# Altium schematic sheet High Voltage Converter.SchDoc
size C
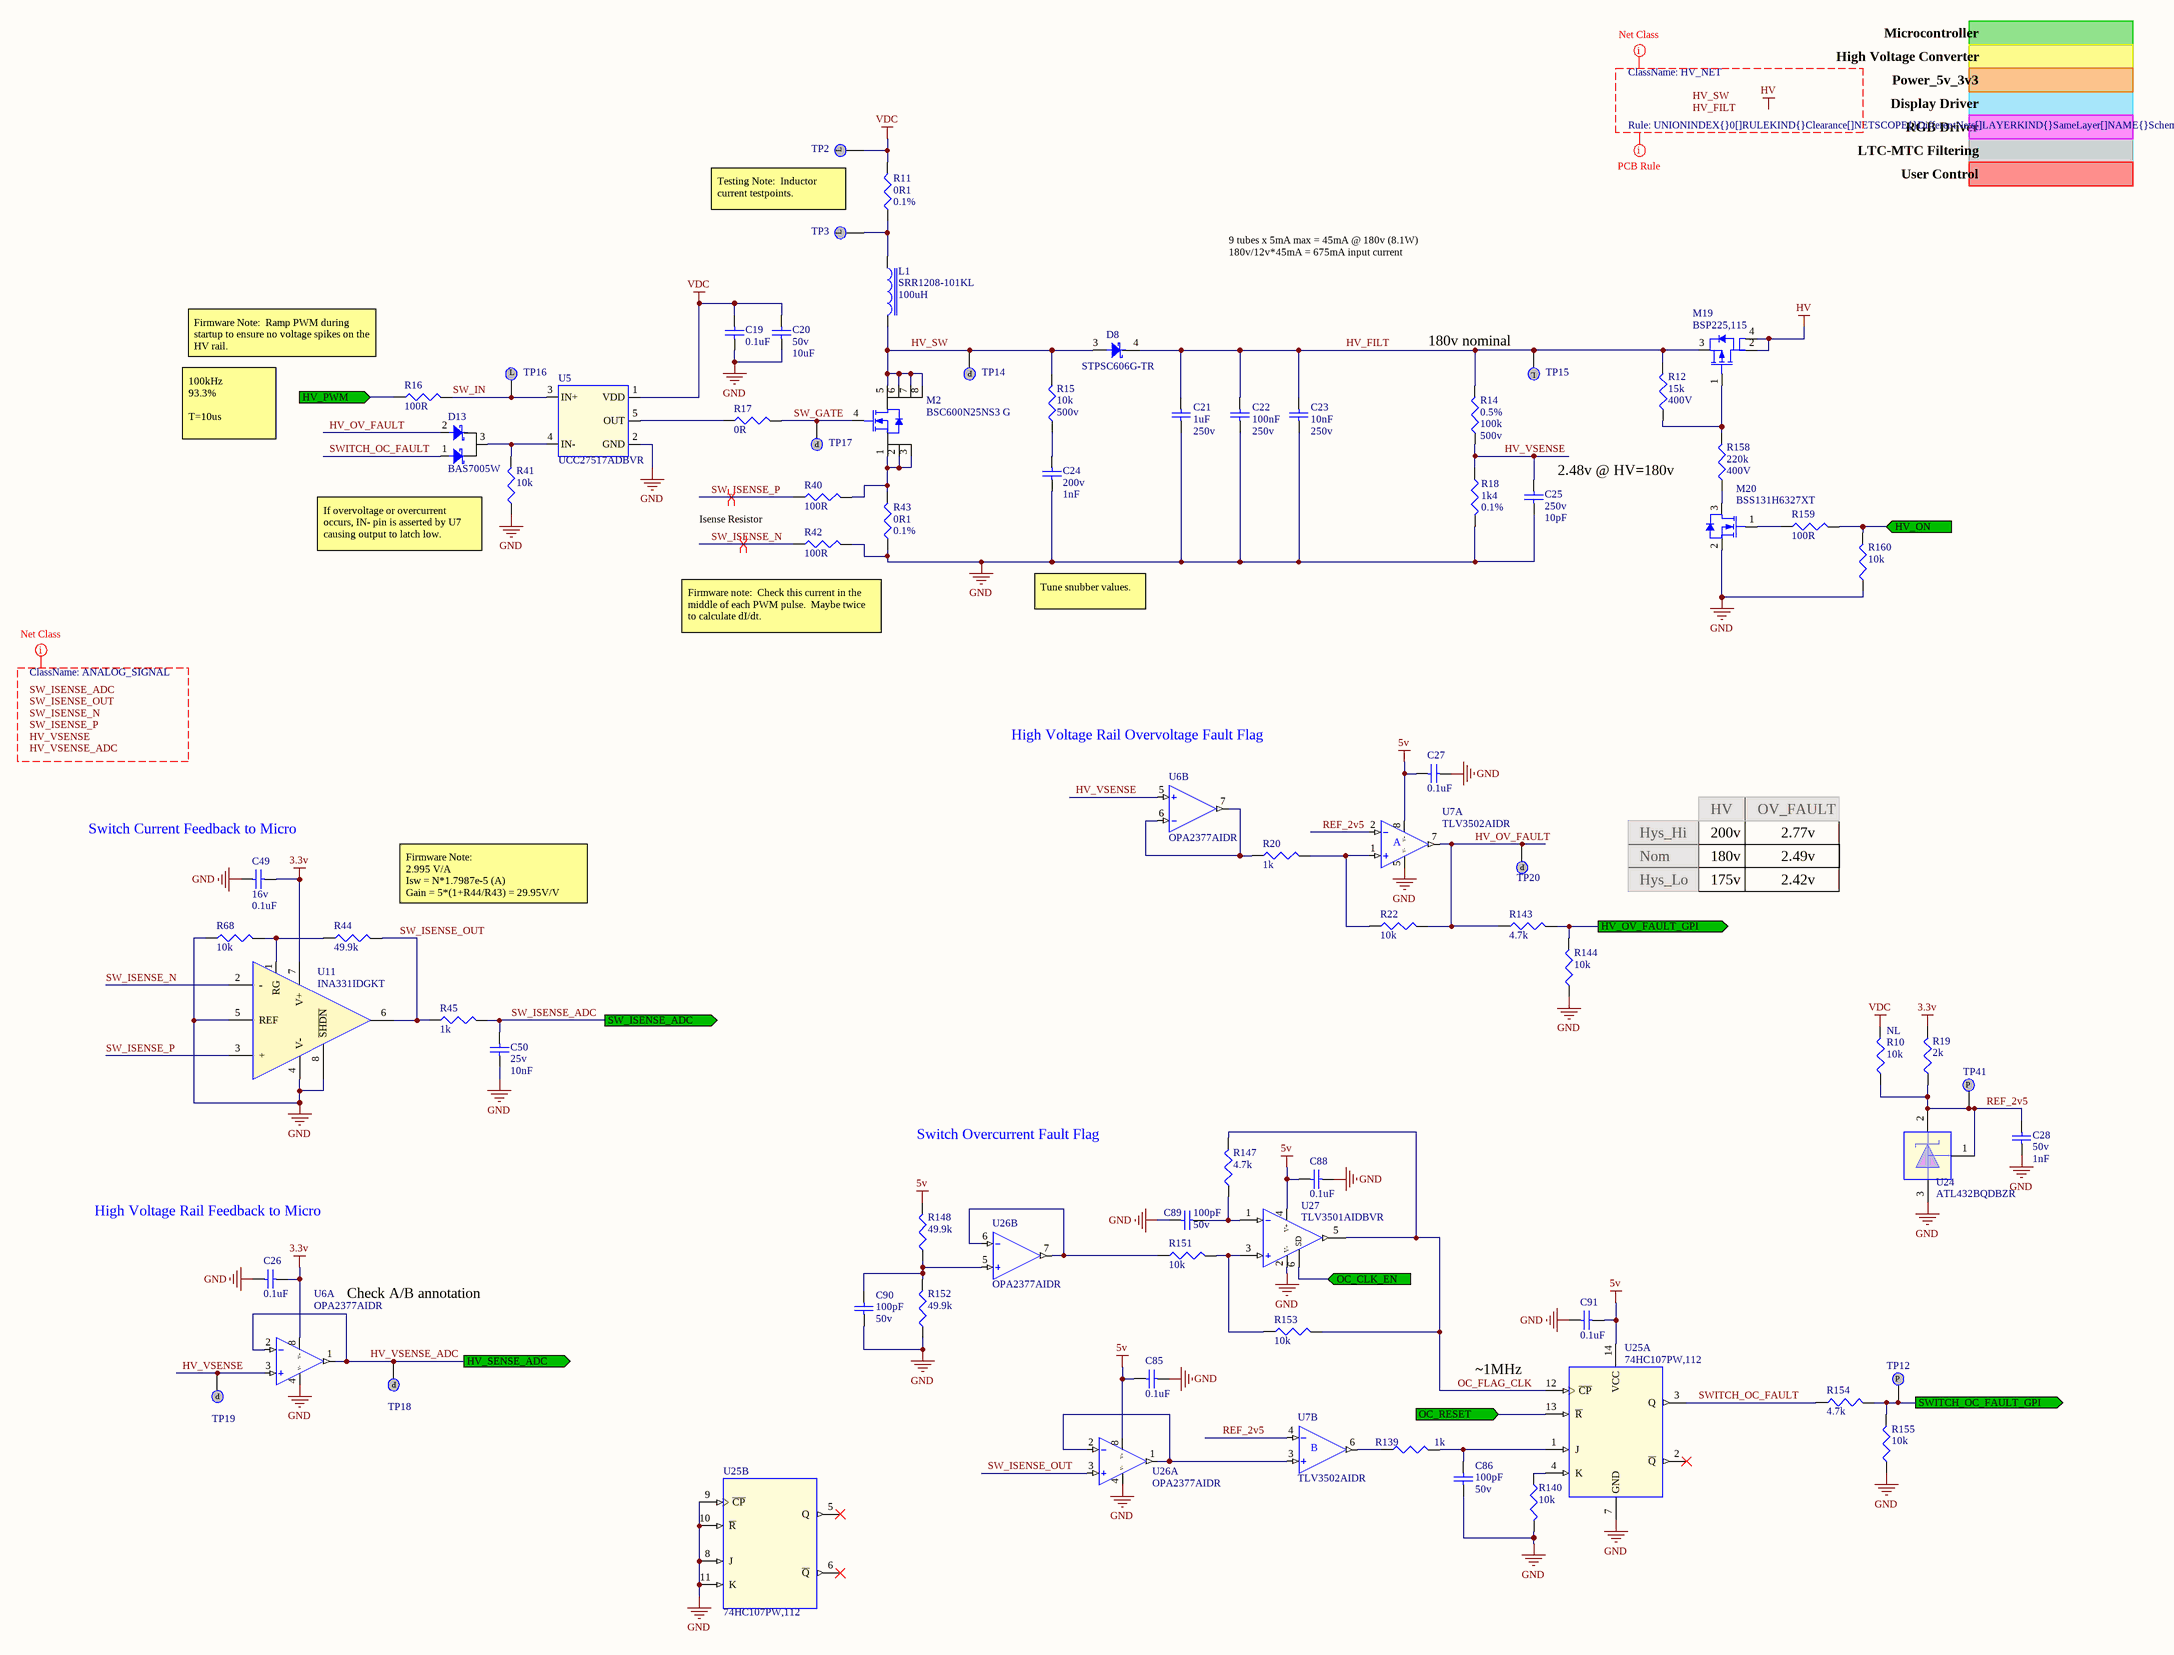
[diagram p0: High Voltage Converter.SchDoc]

## Parts
C19  0.1uF  [CAP0603R]
C20  Voltage: 50v  [CAP1206R]  (hidden comment: 10uF)
C21  Voltage: 250v  [CAP2220R]  (hidden comment: 1uF)
C22  Voltage: 250v  [CAP1206R]  (hidden comment: 100nF)
C23  Voltage: 250v  [CAP0805R]  (hidden comment: 10nF)
C24  Voltage: 200v  [CAP0805R]  (hidden comment: 1nF)
C25  Voltage: 250v  [CAP0805R]  (hidden comment: 10pF)
C26  0.1uF  [CAP0402R]
C27  0.1uF  [CAP0402R]
C28  Voltage: 50v  [CAP0402R]  (hidden comment: 1nF)
C49  Voltage: 16v  [CAP0603R]  (hidden comment: 0.1uF)
C50  Voltage: 25v  [CAP0402R]  (hidden comment: 10nF)
C85  0.1uF  [CAP0402R]
C86  Voltage: 50v  [CAP0402R]  (hidden comment: 100pF)
C88  0.1uF  [CAP0402R]
C89  Voltage: 50v  [CAP0402R]  (hidden comment: 100pF)
C90  Voltage: 50v  [CAP0402R]  (hidden comment: 100pF)
C91  0.1uF  [CAP0402R]
D8  STPSC606G-TR  [D2PAK-3]
D13  BAS7005W  [SOT-323]
L1  MFG_PN: SRR1208-101KL  [SRR1208]  (hidden comment: 100uH)
M2  BSC600N25NS3 G  [PowerPAK-SO8]
M19  BSP225,115  [SOT223]
M20  BSS131H6327XT  [SOT23-3 REFLOW]
R10  Load: NL  [RES0402R]  (hidden comment: 10k)
R11  Tolerance: 0.1%  [RES1206R]  (hidden comment: 0R1)
R12  VOLTAGE: 400V  [RES2010R]  (hidden comment: 15k)
R14  Tolerance: 0.5%  VOLTAGE: 500v  [RES1206R]  (hidden comment: 100k)
R15  VOLTAGE: 500v  [RES1206R]  (hidden comment: 10k)
R16  100R  [RES0402R]
R17  0R  [RES0603R]
R18  Tolerance: 0.1%  [RES0603R]  (hidden comment: 1k4)
R19  2k  [RES0402R]
R20  1k  [RES0402R]
R22  10k  [RES0402R]
R40  100R  [RES0402R]
R41  10k  [RES0402R]
R42  100R  [RES0402R]
R43  Tolerance: 0.1%  [RES1206R]  (hidden comment: 0R1)
R44  49.9k  [RES0402R]
R45  1k  [RES0402R]
R68  10k  [RES0402R]
R139  1k  [RES0402R]
R140  10k  [RES0402R]
R143  4.7k  [RES0402R]
R144  10k  [RES0402R]
R147  4.7k  [RES0402R]
R148  49.9k  [RES0402R]
R151  10k  [RES0402R]
R152  49.9k  [RES0402R]
R153  10k  [RES0402R]
R154  4.7k  [RES0402R]
R155  10k  [RES0402R]
R158  VOLTAGE: 400V  [RES2010R]  (hidden comment: 220k)
R159  100R  [RES0402R]
R160  10k  [RES0402R]
TP2  5001  [5001 Testpoint]  (value not drawn)
TP3  5001  [5001 Testpoint]  (value not drawn)
TP12  NONE  [TESTPOINT - 1.5mm Round Pad]  (value not drawn)
TP14  NONE  [TESTPOINT - 1.5mm Round Pad]  (value not drawn)
TP15  5001  [5001 Testpoint]  (value not drawn)
TP16  5001  [5001 Testpoint]  (value not drawn)
TP17  NONE  [TESTPOINT - 1.5mm Round Pad]  (value not drawn)
TP18  NONE  [TESTPOINT - 1.5mm Round Pad]  (value not drawn)
TP19  NONE  [TESTPOINT - 1.5mm Round Pad]  (value not drawn)
TP20  NONE  [TESTPOINT - 1.5mm Round Pad]  (value not drawn)
TP41  NONE  [TESTPOINT - 1.5mm Round Pad]  (value not drawn)
U5  UCC27517ADBVR  [SOT23-5]
U6  OPA2377AIDR  [SOIC-8]  (parts A,B of 2)
U7  TLV3502AIDR  [SOIC-8]  (parts A,B of 2)
U11  INA331IDGKT  [VSSOP8]
U24  ATL432BQDBZR  [SOT23-3M]
U25  74HC107PW,112  [TSSOP14]  (parts A,B of 2)
U26  OPA2377AIDR  [SOIC-8]  (parts A,B of 2)
U27  TLV3501AIDBVR  [SOT23-6]

## Ports
HV_ON (in), HV_OV_FAULT_GPI (out), HV_PWM (in), HV_SENSE_ADC (out), OC_CLK_EN (in), OC_RESET (in), SW_ISENSE_ADC (out), SWITCH_OC_FAULT_GPI (out)

## Nets
3.3v: C26.2 C49.2 R19.2 U6.8(V+) U11.7(V+)
5v: C27.2 C85.2 C88.2 C91.2 R148.2 U7.8(V+) U25.14(VCC) U26.8(V+) U27.4(V+)
GND: C19.2 C20.1 C21.2 C22.2 C23.2 C24.2 C25.2 C26.1 C27.1 C28.2 C49.1 C50.2 C85.1 C86.2 C88.1 C89.1 C90.2 C91.1 M20.2(SOURCE) R18.2 R41.1 R42.2 R43.1 R68.1 R140.2 R144.1 R152.1 R155.1 R160.1 U5.2(GND) U6.4(V-) U7.5(V-) U11.4(V-) U11.5(REF) U11.8(~{SHDN}) U24.3(A) U25.7(GND) U25.8(J) U25.9(~{CP}) U25.10(~{R}) U25.11(K) U26.4(V-) U27.2(V-)
HV: M19.2(DRAIN) M19.4(DRAIN)
VDC: C19.1 C20.2 R10.2 R11.2 TP2.1 U5.1(VDD)
HV_FILT: C21.1 C22.1 C23.1 D8.4 M19.3(SOURCE) R12.2 R14.2 TP15.1
HV_ON: R159.2 R160.2 ; port HV_ON
HV_OV_FAULT: D13.2(A2) R22.2 R143.1 TP20.1 U7.7(OUT_A)
HV_OV_FAULT_GPI: R143.2 R144.2 ; port HV_OV_FAULT_GPI
HV_PWM: R16.1 ; port HV_PWM
HV_SW: D8.3(A) L1.2 M2.5(DRAIN) M2.6(DRAIN) M2.7(DRAIN) M2.8(DRAIN) R15.2 TP14.1
HV_VSENSE: C25.1 R14.1 R18.1 TP19.1 U6.3(+IN_A) U6.5(+IN_B)
HV_VSENSE_ADC: TP18.1 U6.1(OUT_A) U6.2(-IN_A) ; port HV_SENSE_ADC
OC_CLK_EN: U27.6(SD) ; port OC_CLK_EN
OC_FLAG_CLK: R147.2 R153.2 U25.12(~{CP}) U27.5(OUT_A)
OC_RESET: U25.13(~{R}) ; port OC_RESET
REF_2v5: C28.1 R10.1 R19.1 TP41.1 U7.2(-IN_A) U7.4(-IN_A) U24.1(REF) U24.2(K)
SW_GATE: M2.4(GATE) R17.2 TP17.1
SW_IN: R16.2 TP16.1 U5.3(IN+)
SW_ISENSE_ADC: C50.1 R45.2 ; port SW_ISENSE_ADC
SW_ISENSE_N: R42.1 U11.2(-)
SW_ISENSE_OUT: R44.2 R45.1 U11.6(OUT) U26.3(+IN_A)
SW_ISENSE_P: R40.1 U11.3(+)
SWITCH_OC_FAULT: D13.1(A1) R154.1 U25.3(Q)
SWITCH_OC_FAULT_GPI: R154.2 R155.2 TP12.1 ; port SWITCH_OC_FAULT_GPI
NetC24_1: C24.1 R15.1
NetC86_1: C86.1 R139.2 U25.1(J)
NetC89_2: C89.2 R147.1 U27.1(-IN_A)
NetC90_1: C90.1 R148.1 R152.2 U26.5(+IN_B)
NetD13_3: D13.3(C) R41.2 U5.4(IN-)
NetL1_1: L1.1 R11.1 TP3.1
NetM2_1: M2.1(SOURCE) M2.2(SOURCE) M2.3(SOURCE) R40.2 R43.2
NetM19_1: M19.1(GATE) R12.1 R158.2
NetM20_1: M20.1(GATE) R159.1
NetM20_3: M20.3(DRAIN) R158.1
NetR17_1: R17.1 U5.5(OUT)
NetR20_1: R20.1 U6.6(-IN_B) U6.7(OUT_B)
NetR20_2: R20.2 R22.1 U7.1(+IN_A)
NetR44_1: R44.1 R68.2 U11.1(RG)
NetR139_1: R139.1 U7.6(OUT_A)
NetR140_1: R140.1 U25.4(K)
NetR151_1: R151.1 U26.6(-IN_B) U26.7(OUT_B)
NetR151_2: R151.2 R153.1 U27.3(+IN_A)
NetU7_3: U7.3(+IN_A) U26.1(OUT_A) U26.2(-IN_A)

Not connected (* = marked no-connect by the designer): U25 2(~{Q})* 5(Q)* 6(~{Q})*

## Layout directives
differential pair: SW_ISENSE_N, SW_ISENSE_P
net class HV_NET: HV, HV_FILT, HV_SW
rule Clearance Constraint [Clearance = 10mil]: HV, HV_FILT, HV_SW
net class ANALOG_SIGNAL: HV_VSENSE, HV_VSENSE_ADC, SW_ISENSE_ADC, SW_ISENSE_N, SW_ISENSE_OUT, SW_ISENSE_P

## Notes on the sheet
- Microcontroller
- High Voltage Converter
- Power_5v_3v3
- Display Driver
- RGB Driver
- LTC-MTC Filtering
- Testing Note:  Inductor current testpoints.
- User Control
- 9 tubes x 5mA max = 45mA @ 180v (8.1W)
  180v/12v*45mA = 675mA input current
- Firmware Note:  Ramp PWM during startup to ensure no voltage spikes on the HV rail.
- (near TP15) 180v nominal
- 100kHz
  93.3%
  T=10us
- (near C25) 2.48v @ HV=180v
- If overvoltage or overcurrent occurs, IN- pin is asserted by U7 causing output to latch low.
- Isense Resistor
- Tune snubber values.
- Firmware note:  Check this current in the middle of each PWM pulse.  Maybe twice to calculate dI/dt.
- High Voltage Rail Overvoltage Fault Flag
- (near C49) Switch Current Feedback to Micro
- Nom
- Hys_Hi
- 180v
- 200v
- HV
- OV_FAULT
- 2.49v
- 2.77v
- (near R44) Firmware Note:
  2.995 V/A
  Isw = N*1.7987e-5 (A)
  Gain = 5*(1+R44/R43) = 29.95V/V
- Hys_Lo
- 175v
- 2.42v
- Switch Overcurrent Fault Flag
- High Voltage Rail Feedback to Micro
- Check A/B annotation
- ~1MHz
- Labels drawn without touching a wire or pin: HV, HV_FILT, HV_SW, HV_VSENSE, HV_VSENSE_ADC, SW_ISENSE_ADC, SW_ISENSE_N, SW_ISENSE_OUT, SW_ISENSE_P
- (in symbol Testpoint 1.5mm Pad) P
- (in symbol Testpoint Loop) L
- (in symbol TLV3502AIDR, part A) A
- (in symbol TLV3502AIDR, part B) B

## Library data of the parts
C19 = 0.1uF 50v (0603): MFG_PN: VJ0603V104ZXAPW1BC; MFG: Vishay; Voltage: 50v; LOAD: NL; Value: 0.1uF
C20 = 10uF 50v (1206): Tolerance: 10%; MFG_PN: C3216X5R1H106K160AB; MFG: TDK; LOAD: NL; Value: 10uF
C21 = 1uF 250v (2220): Tolerance: 10%; MFG_PN: GRM55DR72E105KW01L; MFG: Murata; LOAD: NL; Value: 1uF
C22 = 100nF 250v (1206): Tolerance: 10%; MFG_PN: GRM31CR72E104KW03L; MFG: Murata; LOAD: NL; Value: 100nF
C23 = 10nF 250v (0805): Tolerance: 10%; MFG_PN: GRM21BR72E103KW03L; MFG: Murata; LOAD: NL; Value: 10nF
C24 = 1nF 200v (0805): MFG_PN: VJ0805Y102KXCAC; MFG: Vishay; LOAD: NL; Value: 1nF
C25 = 10pF 250V (0805): Tolerance: 5%; MFG_PN: GQM2195C2E100JB12D; MFG: Murata; LOAD: NL; Value: 10pF
C26 C27 C85 C88 C91 = 0.1uF 10v (0402): Tolerance: 20%; MFG_PN: VJ0402G104MXQCW1BC; MFG: Vishay; Voltage: 10v; LOAD: NL; Value: 0.1uF
C28 = 1nF 50v (0402): Tolerance: 10%; MFG_PN: VJ0402Y102KXAAC; MFG: Vishay; LOAD: NL; Value: 1nF
C49 = 0.1uF 16v (0603): MFG_PN: VJ0603Y104JXJPW1BC; MFG: Vishay; LOAD: NL; Value: 0.1uF
C50 = 10nF 25v (0402): Tolerance: 5%; MFG_PN: VJ0402Y103JXXAC; MFG: Vishay; LOAD: NL; Value: 10nF
C86 C89 C90 = 100pF 50v (0402): Tolerance: 10%; MFG_PN: GCM1555C1H101JA16D; MFG: MURATA; LOAD: NL; Value: 100pF
D8 = STPSC606G-TR: Schottky, 6A, 600v; MFG: STMICRO; MFG_PN: STPSC606G-TR; CURRENT: 6A; VREV: 600v
D13 = BAS7005WH6327XTSA1: Schottky, Dual, Common Cathode; MFG: Vishay; IFORWARD: 70mA; VFORWARD: 880mV; Value: *; CONFIGURATION: COMMON CATHODE; MFG_PN: BAS7005WH6327XTSA1
L1 = 100uH_SRR1208: MFG: Bourns; CURRENT: 1.5A; RESISTANCE: 170u; ISAT: 2.1A; Value: 100uH
M2 = BSC600N25NS3 G: NFET_SINGLE_25A_250V; LOAD: NL; MFG: Infineon; VDS_MAX: 250v; I_MAX: 2.3A; VGS_MAX: 20v; GATE_CHARGE: 10nC; MFG_PN: BSC600N25NS3 G
M19 = BSP225,115: PFET_SINGLE_0.225A_1.5W_250V; LOAD: NL; MFG: NXP; VDS_MAX: -250V; I_MAX: 225mA; VGS_MAX: 20V; P_MAX: 50W; RDS_ON: 10R; MFG_PN: BSP225,115
M20 = BSS131H6327XT: NFET_SINGLE_100mA_240v; MFG: INFINEON; VDS: 240v; VGS: 20v; RDS: 14R; CURRENT: 0.1A; MFG_PN: BSS131H6327XT
R10 = 10k (0402): Tolerance: 1%; POWER: 63mW; MFG_PN: CRCW040210K0FKED; MFG: Vishay; Value: 10k
R11 R43 = 100m 0.1% (1206): POWER: 1W; MFG_PN: WSL1206R1000DEA; MFG: Vishay; Load: NL; Value: 0R1
R12 = 15k 400v (2010): Tolerance: 1%; POWER: 0.750mW; MFG_PN: CRCW201015K0FKEF; MFG: VISHAY; Load: NL; Value: 15k
R14 = 100k 500v (1206): POWER: 0.25mW; MFG_PN: HV732BTTD1003D; MFG: KOA SPEER; Load: NL; Value: 100k
R15 = 10k 500v (1206): Tolerance: 5%; POWER: 0.66mW; MFG_PN: ERJ-P08J103V; MFG: Panasonic; Load: NL; Value: 10k
R16 R40 R42 R159 = 100R (0402): Tolerance: 1%; POWER: 63mW; MFG_PN: CRCW0402100RFKED; MFG: Vishay; Load: NL; Value: 100R
R17 = 0R (0603): MFG_PN: CRCW12060000Z0EA; MFG: Vishay; Load: NL; Value: 0R
R18 = 1k4   0.1%: POWER: 0.1W; MFG1_PN: TNPW06031K40BEEA; MFG1: Vishay; Load: NL; Value: 1k4
R19 = 2k (0402): Tolerance: 1%; POWER: 63mW; MFG_PN: CRCW04022K00FKED; MFG: Vishay; Load: NL; Value: 2k
R20 R45 R139 = 1k (0402): Tolerance: 1%; POWER: 63mW; MFG_PN: CRCW04021K00FKED; MFG: Vishay; Load: NL; Value: 1k
R22 R41 R68 R140 R144 R151 R153 R155 R160 = 10k (0402): Tolerance: 1%; POWER: 63mW; MFG_PN: CRCW040210K0FKED; MFG: Vishay; Load: NL; Value: 10k
R44 R148 R152 = 49.9k (0402): Tolerance: 1%; POWER: 63mW; MFG_PN: CRCW040249K9FKED; MFG: Vishay; Load: NL; Value: 49.9k
R143 R147 R154 = 4.7k (0402): Tolerance: 1%; POWER: 63mW; MFG_PN: CRCW04024K70FKED; MFG: Vishay; Load: NL; Value: 4.7k
R158 = 220k 400v (2010): Tolerance: 1%; POWER: 0.750mW; MFG_PN: CRCW2010220KFKEF; MFG: VISHAY; Load: NL; Value: 220k
TP2 TP3 TP15 TP16 = Testpoint Loop: MFG: KEYSTONE; MFG_PN: 5001
TP12 TP14 TP17-TP20 TP41 = Testpoint 1.5mm Pad: 1.5mm Testpoint
U5 = UCC27517ADBVR: Low Side Gate Driver; MFG: TI; VMAX: 18v; ISOURCE: 4A; LOAD: NL; MFG_PN: UCC27517ADBVR; ISINK: 4A
U6 U26 = OPA2377AIDR: OpAmp - 2 Channel; LOAD: NL; MFG: TI; CHANNELS: 2; GBP: 5MHz; SINGLE_SUPPLY: TRUE; VMAX: 5.5v; OFFSET_VOLTAGE: 1mV; MFG_PN: OPA2377AIDR
U7 = TLV3502AIDR: Comparator, Dual, High Speed; LOAD: NL; MFG: TI; VMIN: 2.2v; VMAX: 5.5v; VOFFSET: 6.5mV; RESPONSE_TIME: 4.5ns; MFG_PN: TLV3502AIDR
U11 = INA331IDGKT: Instrumentation Amplifier - 1 Channel; MFG: TI; LOAD: NL; GBP: 2MHz; VMAX: 5.5v; SINGLE_SUPPLY: TRUE; VOFFSET: 500uV; MFG_PN: INA331IDGKT
U24 = ATL432BQDBZR: Shunt Voltage Reference, 0.5%; MFG: TI; VREF: 2.500v; MFG_PN: ATL432BQDBZR
U25 = 74HC107D,653: Dual JK Flip Flop, Neg Edge Triggered; MFG: NXP; CHANNELS: 2; VMIN: 2v; VMAX: 6v; MFG_PN: 74HC107PW,112
U27 = TLV3501AIDBVR: Comparator, Single, High Speed; LOAD: NL; MFG: TI; VMIN: 2.2v; VMAX: 5.5v; VOFFSET: 6.5mV; RESPONSE_TIME: 4.5ns; MFG_PN: TLV3501AIDBVR